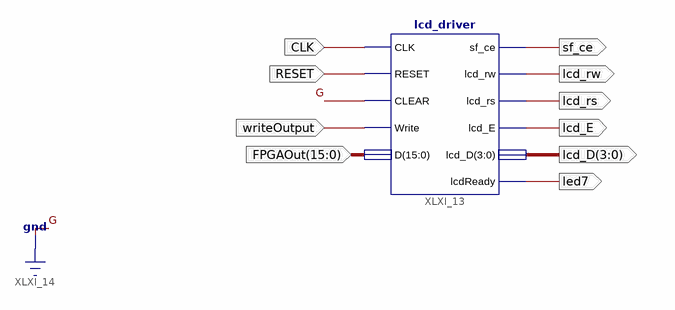
[diagram p0: schematic sheet 1]
// Xilinx ISE schematic FPGAOut.sch (spartan3e) as structural Verilog: 1 symbols, 10 ports
module FPGAOut (
  input  writeOutput,
  input  RESET,
  input  CLK,
  input  [15:0] FPGAOut,
  output led7,
  output [3:0] lcd_D,
  output lcd_rs,
  output lcd_E,
  output lcd_rw,
  output sf_ce
);

  lcd_driver XLXI_13 (
    .CLK(CLK), .RESET(RESET), .CLEAR(1'b0), .Write(writeOutput), .D(FPGAOut), .sf_ce(sf_ce), .lcd_rw(lcd_rw),
    .lcd_rs(lcd_rs), .lcd_D(lcd_D), .lcd_E(lcd_E), .lcdReady(led7));
endmodule
